# Altium schematic sheet toothpickBox.SchDoc
size A4
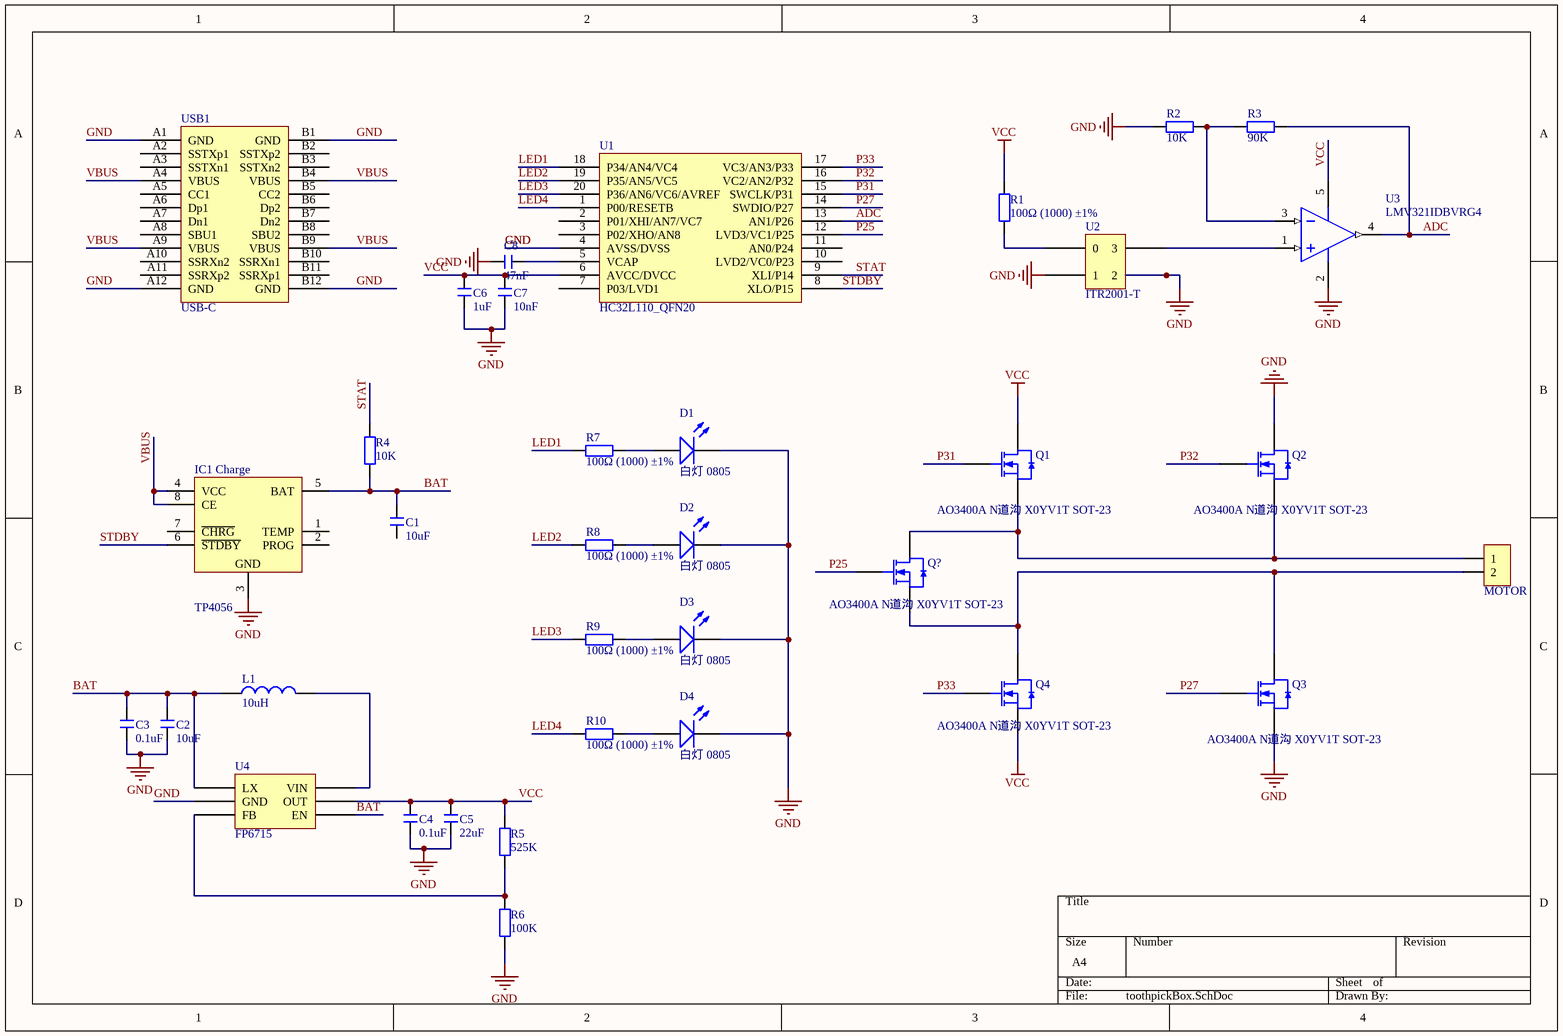
[diagram p0: toothpickBox.SchDoc]

## Parts
C1  10uF  [C 0805_L]
C2  10uF  [C 0805_L]
C3  0.1uF  [C 0805_L]
C4  0.1uF  [C 0805_L]
C5  22uF  [C 0805_L]
C6  1uF  [C 0805_L]
C7  10nF  [C 0805_L]
C8  47nF  [C 0805_L]
D1  白灯 0805  [0805_LED_S1]
D2  白灯 0805  [0805_LED_S1]
D3  白灯 0805  [0805_LED_S1]
D4  白灯 0805  [0805_LED_S1]
IC1_Charge  TP4056  [SOP8_N]
L1  10uH  [L 0805]
MOTOR  HDR-1X2  [XH2.54-WI-2P]  (value not drawn)
Q1  AO3400A N道沟 X0YV1T SOT-23  [SOT-23-3L]
Q2  AO3400A N道沟 X0YV1T SOT-23  [SOT-23-3L]
Q3  AO3400A N道沟 X0YV1T SOT-23  [SOT-23-3L]
Q4  AO3400A N道沟 X0YV1T SOT-23  [SOT-23-3L]
Q?  AO3400A N道沟 X0YV1T SOT-23  [SOT-23-3L]
R1  100Ω (1000) ±1%  [0603_R]
R2  10K  [0603_R]
R3  90K  [0603_R]
R4  10K  [0603_R]
R5  525K  [0603_R]
R6  100K  [0603_R]
R7  100Ω (1000) ±1%  [0603_R]
R8  100Ω (1000) ±1%  [0603_R]
R9  100Ω (1000) ±1%  [0603_R]
R10  100Ω (1000) ±1%  [0603_R]
U1  HC32L110_QFN20  [QFN20 4x4_N]
U2  ITR2001-T  [ITR2000]
U3  LMV321IDBVRG4  [SOT23-5N]
U4  FP6715  [SOT23-6N]
USB1  USB-C  [USB-C/S_A]

## Nets
GND: C2.1 C3.1 C4.1 C5.1 C6.1 C7.1 C8.2 D1.K D2.K D3.K D4.K IC1_Charge.3(GND) Q2.3(D) Q3.2(S) R2.2 R6.2 U1.4(AVSS/DVSS) U2.1 U2.2 U3.2(V-) U4.2(GND) USB1.A1(GND) USB1.A12(GND) USB1.B1(GND) USB1.B12(GND)
VCC: C4.2 C5.2 C6.2 C7.2 Q1.3(D) Q4.2(S) R1.2 R5.1 U1.6(AVCC/DVCC) U3.5(V+) U4.5(OUT)
ADC: R3.1 U1.13(AN1/P26) U3.4(OUT)
BAT: C1.2 C2.2 C3.2 IC1_Charge.5(BAT) L1.1 R4.2 U4.1(LX) U4.4(EN)
LED1: R7.1 U1.18(P34/AN4/VC4)
LED2: R8.1 U1.19(P35/AN5/VC5)
LED3: R9.1 U1.20(P36/AN6/VC6/AVREF)
LED4: R10.1 U1.1(P00/RESETB)
P25: Q?.1(G) U1.12(LVD3/VC1/P25)
P27: Q3.1(G) U1.14(SWDIO/P27)
P31: Q1.1(G) U1.15(SWCLK/P31)
P32: Q2.1(G) U1.16(VC2/AN2/P32)
P33: Q4.1(G) U1.17(VC3/AN3/P33)
STAT: R4.1 U1.9(XLI/P14)
STDBY: IC1_Charge.6(~{STDBY}) U1.8(XLO/P15)
VBUS: IC1_Charge.4(VCC) IC1_Charge.8(CE) USB1.A4(VBUS) USB1.A9(VBUS) USB1.B4(VBUS) USB1.B9(VBUS)
NetC8_1: C8.1 U1.5(VCAP)
NetD1_A: D1.A R7.2
NetD2_A: D2.A R8.2
NetD3_A: D3.A R9.2
NetD4_A: D4.A R10.2
NetL1_2: L1.2 U4.6(VIN)
NetMOTOR_1: MOTOR.1 Q1.2(S) Q2.2(S) Q?.3(D)
NetMOTOR_2: MOTOR.2 Q3.3(D) Q4.3(D) Q?.2(S)
NetR1_1: R1.1 U2.0
NetR2_1: R2.1 R3.2 U3.3(IN-)
NetR5_2: R5.2 R6.1 U4.3(FB)
NetU2_3: U2.3 U3.1(IN+)

Not connected (* = marked no-connect by the designer): C1 1; IC1_Charge 1(TEMP) 2(PROG) 7(~{CHRG}); U1 2(P01/XHI/AN7/VC7) 3(P02/XHO/AN8) 7(P03/LVD1) 10(LVD2/VC0/P23) 11(AN0/P24); USB1 A2(SSTXp1) A3(SSTXn1) A5(CC1) A6(Dp1) A7(Dn1) A8(SBU1) A10(SSRXn2) A11(SSRXp2) B2(SSTXp2) B3(SSTXn2) B5(CC2) B6(Dp2) B7(Dn2) B8(SBU2) B10(SSRXn1) B11(SSRXp1)

## Library data of the parts
C1-C8 = C: 贴片电容; BOM名称: 无极性贴片电容; 淘宝ID: 封装库来自淘宝 ID：云叵工作室
D1-D4 = 0805 白灯: 发光二极管; ComponentLink1Description: 供应商链接; ComponentLink1URL: http://www.szlcsc.com/product/details_35468.html; Package: 0805; Supplier: LC; SuppliersPartNumber: C34499
IC1_Charge = TP4056: 锂电池充电管理; BOM名称: 锂电池充电管理
L1 = L: 小功率贴片电感; BOM名称: 小功率贴片电感
MOTOR = Header 2: 2P接插件; BOM名称: 2P接插件
Q1-Q4 Q? = AO3400A N道沟 X0YV1T SOT-23: MOS(场效应管); ComponentLink1Description: 供应商链接; ComponentLink1URL: http://www.szlcsc.com/product/details_21629.html; Package: SOT-23; Supplier: LC; SuppliersPartNumber: C20917
R1-R10 = 0603 100Ω (1000) 1%: 贴片电阻; ComponentLink1Description: 供应商链接; ComponentLink1URL: http://www.szlcsc.com/product/details_23502.html; Package: 0603; Supplier: LC; SuppliersPartNumber: C22775
U2 = Component_1
U3 = LMV321IDBVRG4_[C7972]: 运放; ComponentLink1Description: 供应商链接; ComponentLink1URL: http://www.szlcsc.com/product/details_8449.html; Package: SOT-23-5; Supplier: LC; SuppliersPartNumber: C7972
USB1 = USB-C/S: USB-C型母接口; BOM名称: USB-C型母接口